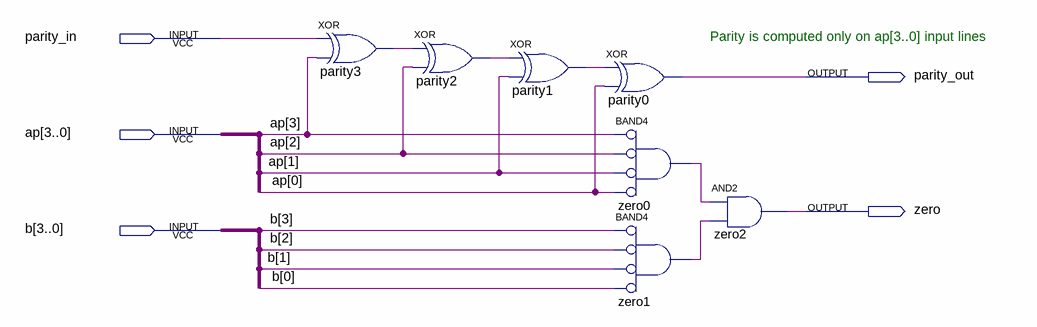
[diagram p0: schematic sheet]
// Quartus schematic alu_zero.bdf as structural Verilog: 7 symbols, 5 pins
module alu_zero (
  input  parity_in,
  input  [3:0] ap,
  input  [3:0] b,
  output parity_out,
  output zero
);

  wire parity1_out, parity2_out, parity3_out, zero0_out, zero1_out;

  xor parity3 (parity3_out, parity_in, ap[3]);
  xor parity2 (parity2_out, parity3_out, ap[2]);
  xor parity1 (parity1_out, parity2_out, ap[1]);
  xor parity0 (parity_out, parity1_out, ap[0]);
  and zero0 (zero0_out, ~ap[3], ~ap[2], ~ap[1], ~ap[0]);  // BAND4
  and zero1 (zero1_out, ~b[3], ~b[2], ~b[1], ~b[0]);  // BAND4
  and zero2 (zero, zero0_out, zero1_out);

  // Notes on the sheet:
  //   Parity is computed only on ap[3..0] input lines
endmodule
